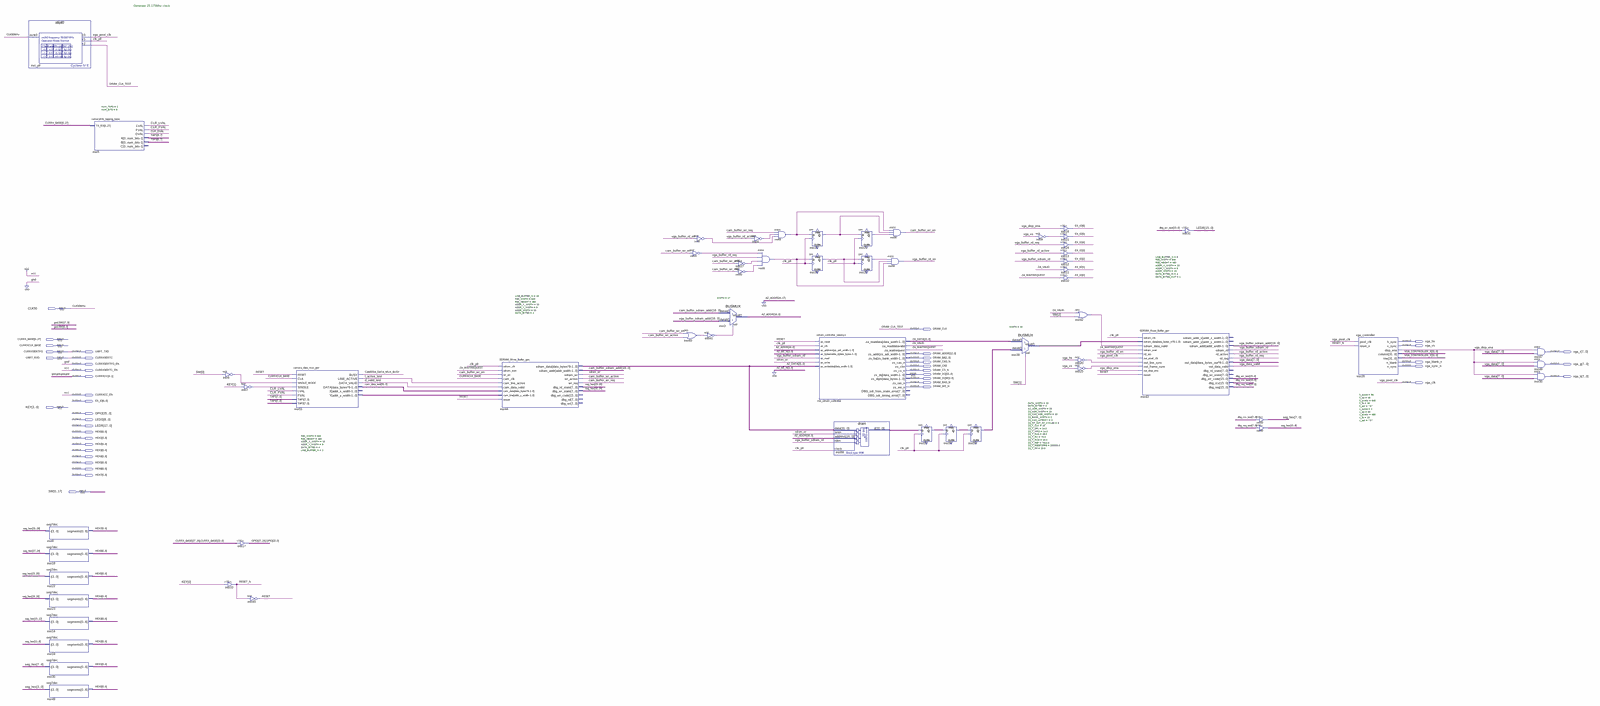
[diagram p0: schematic sheet, whole]
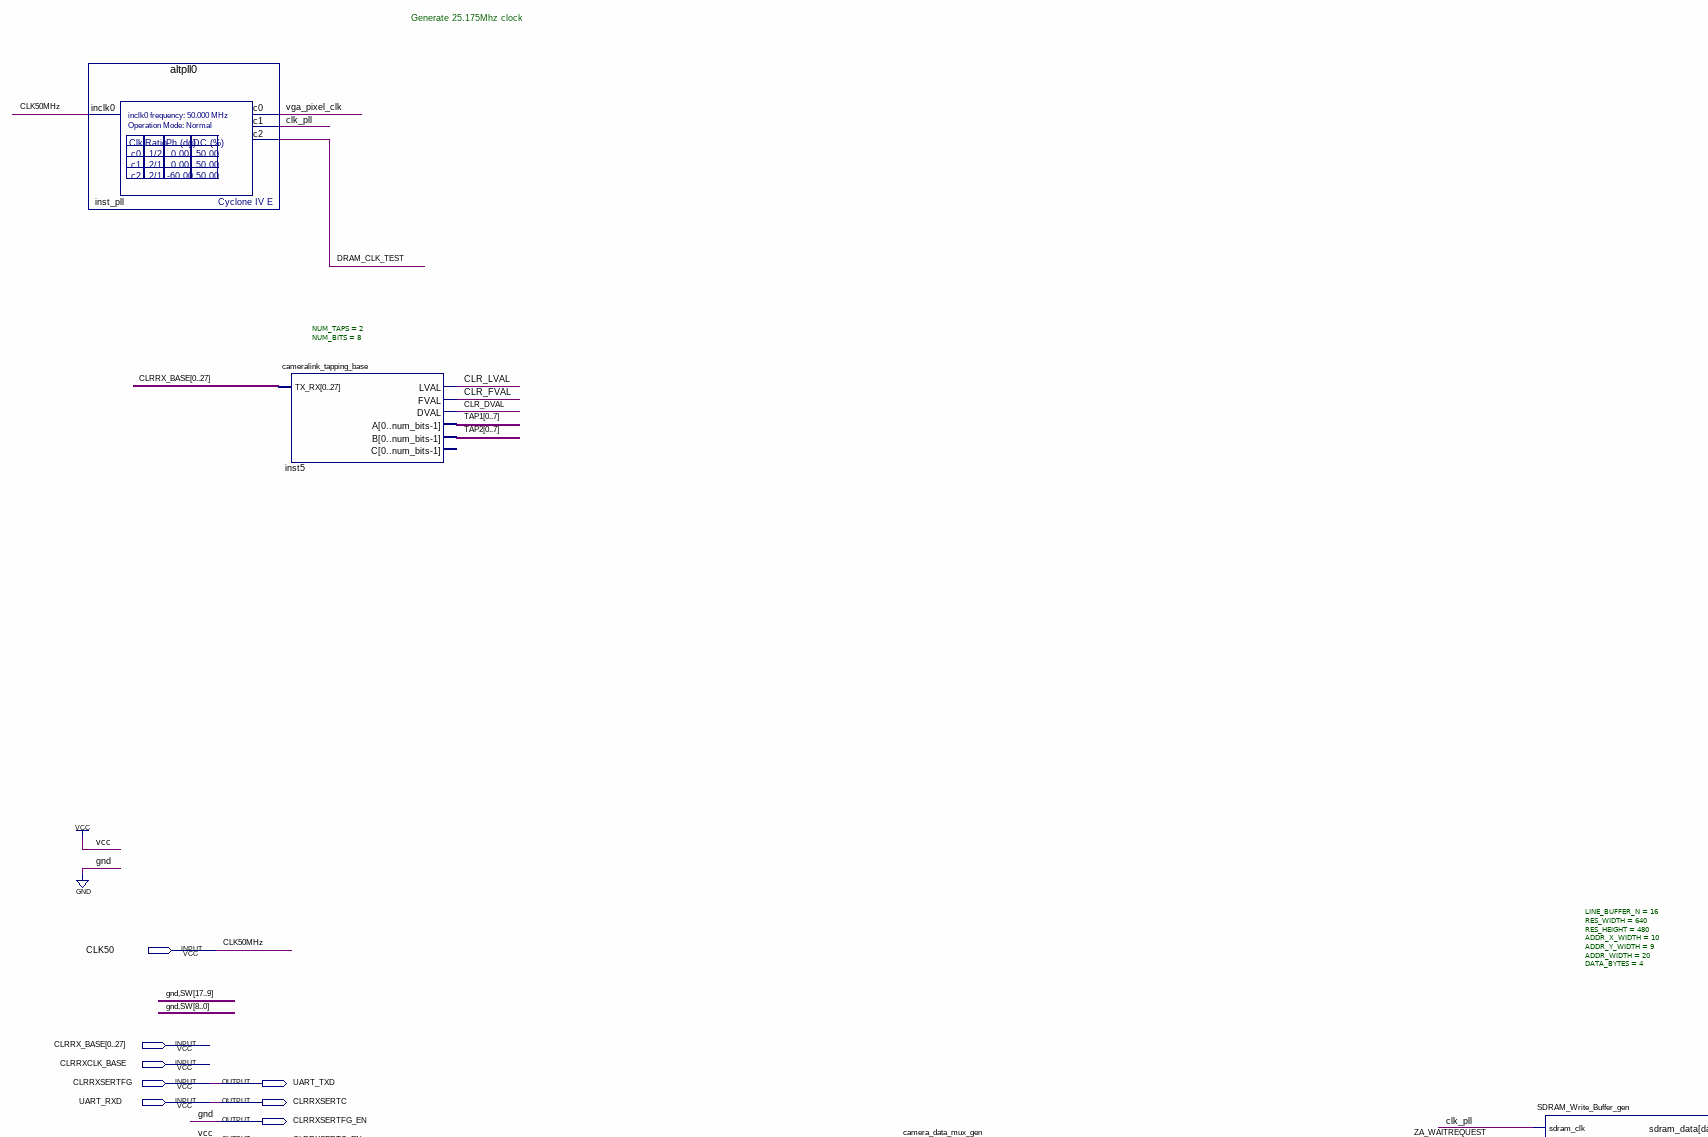
[diagram p1: schematic sheet, upper left part]
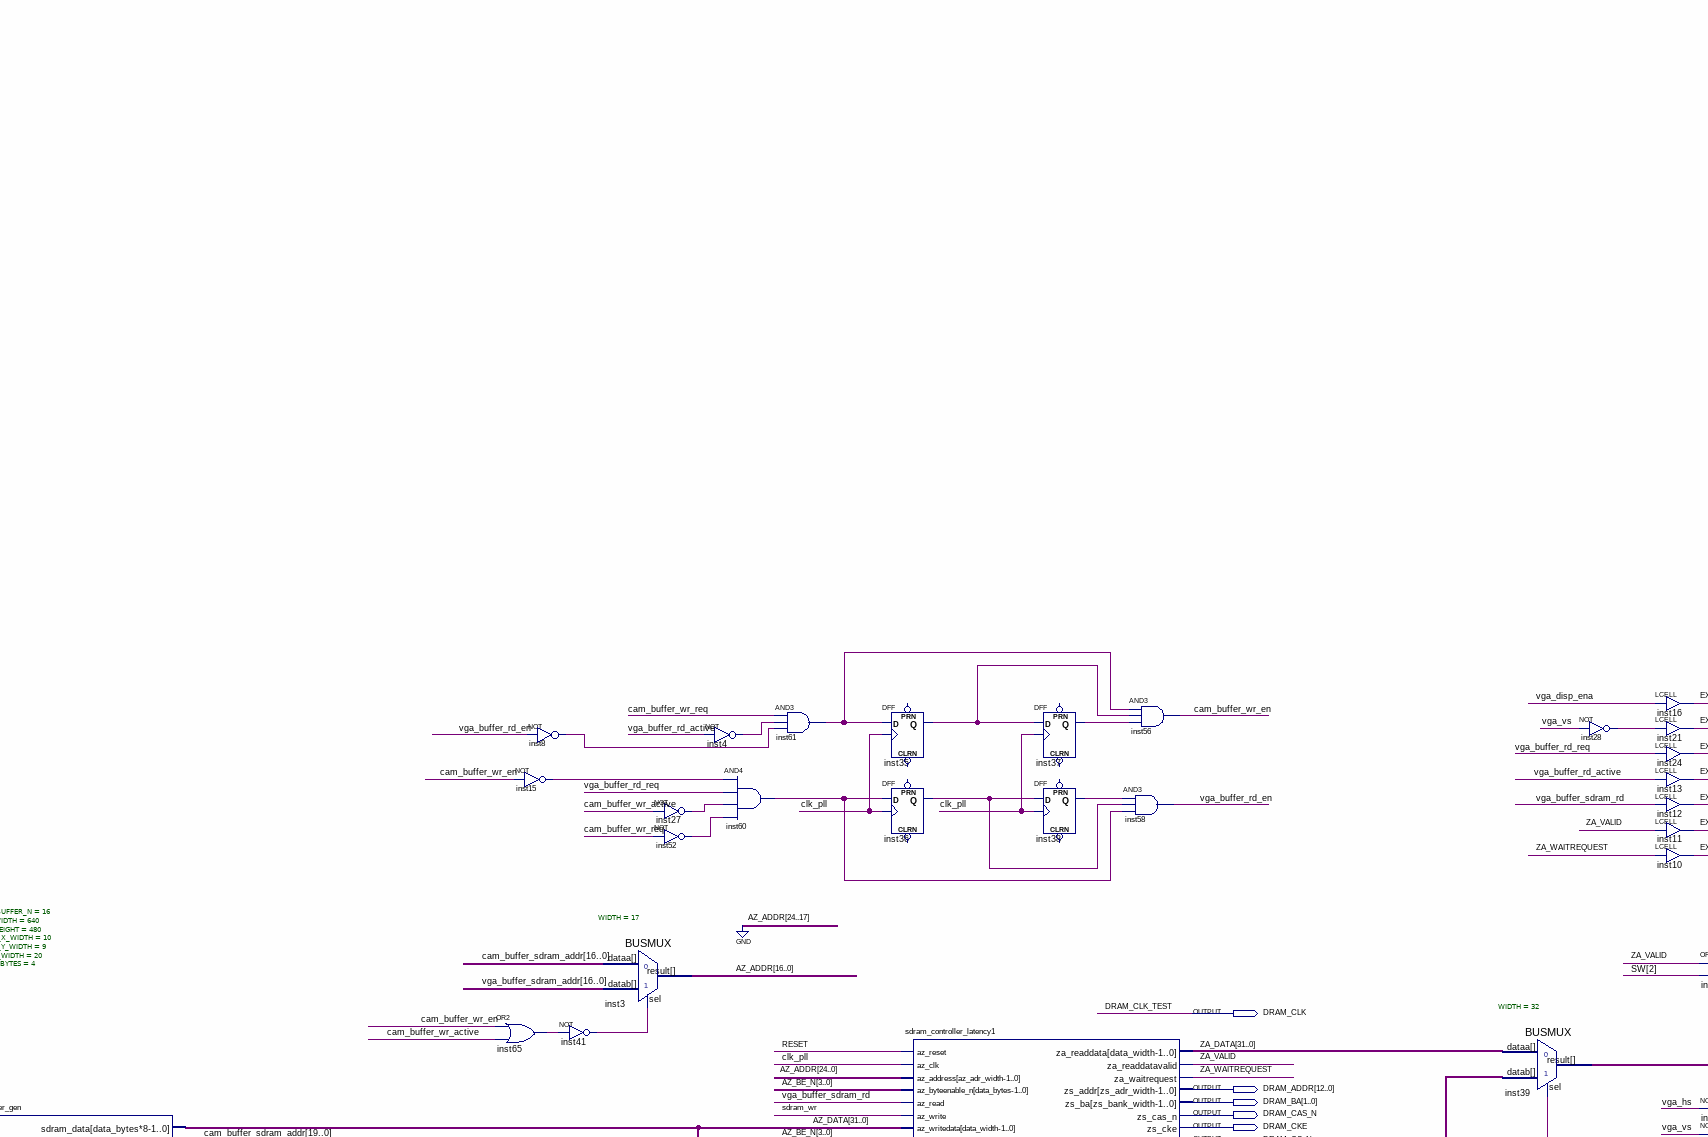
[diagram p2: schematic sheet, upper centre part]
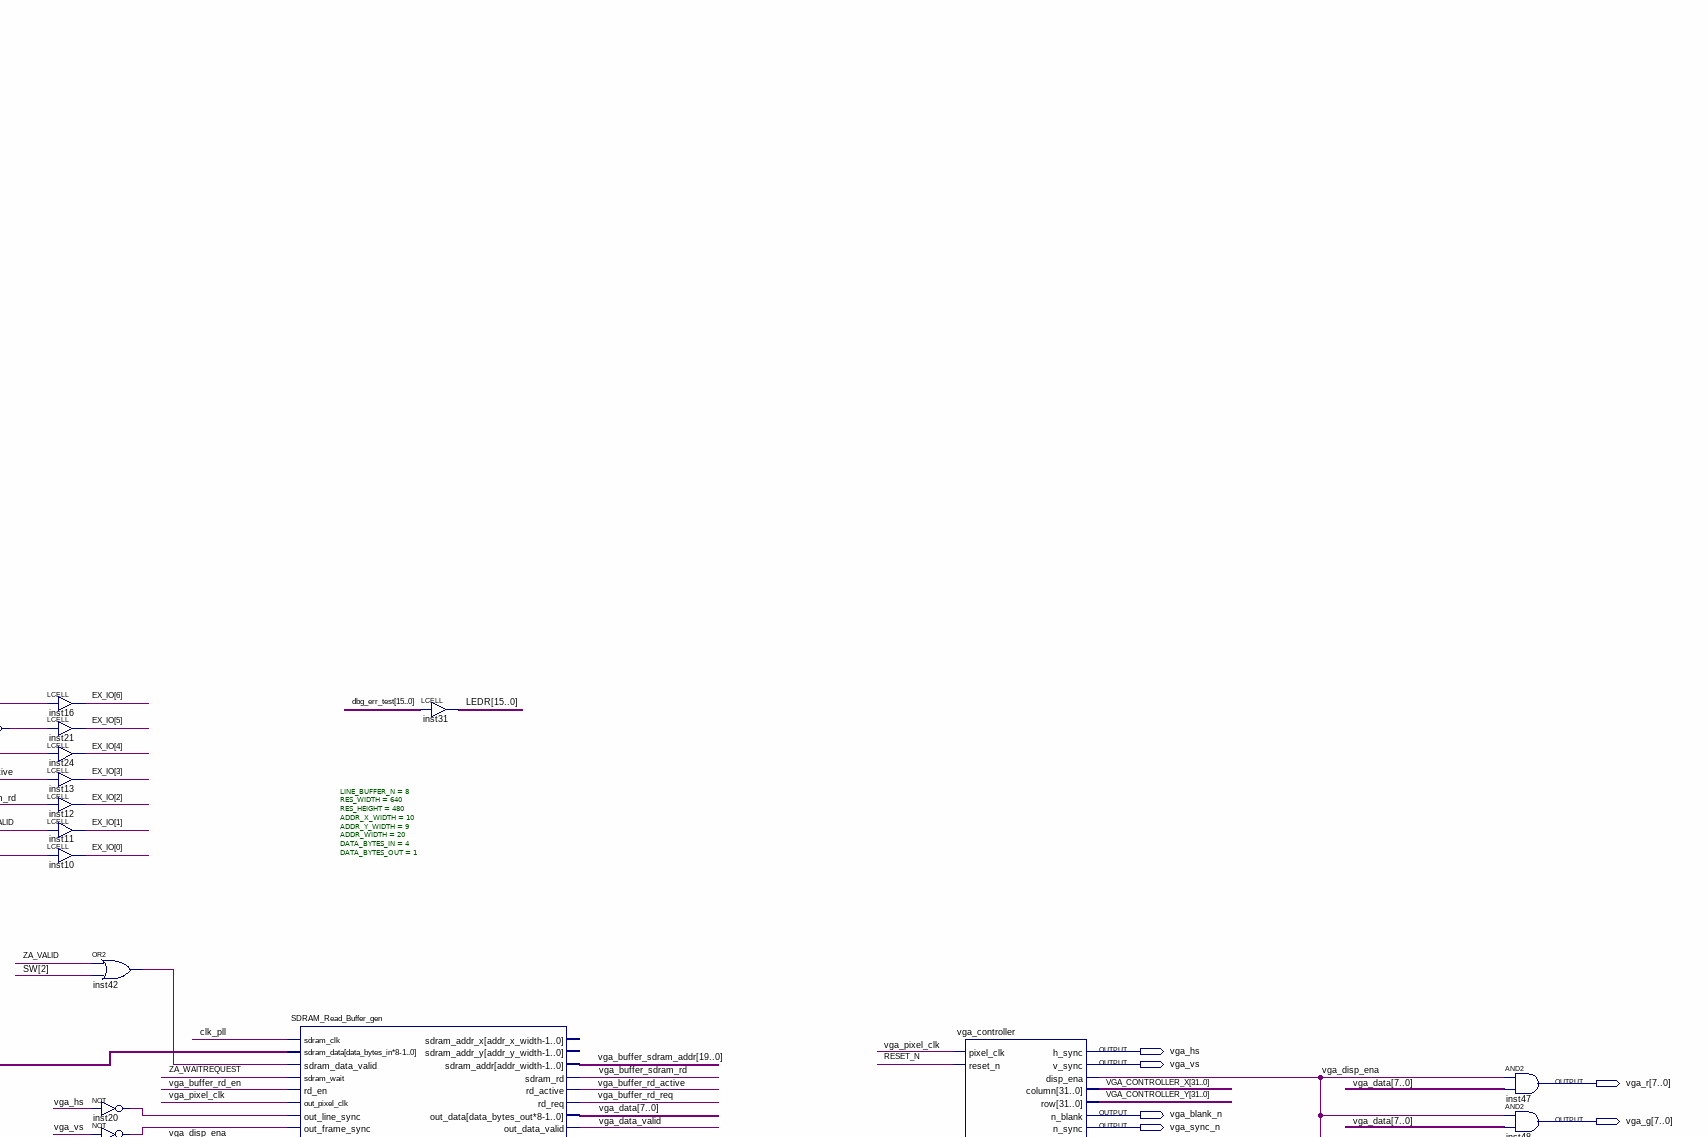
[diagram p3: schematic sheet, upper right part]
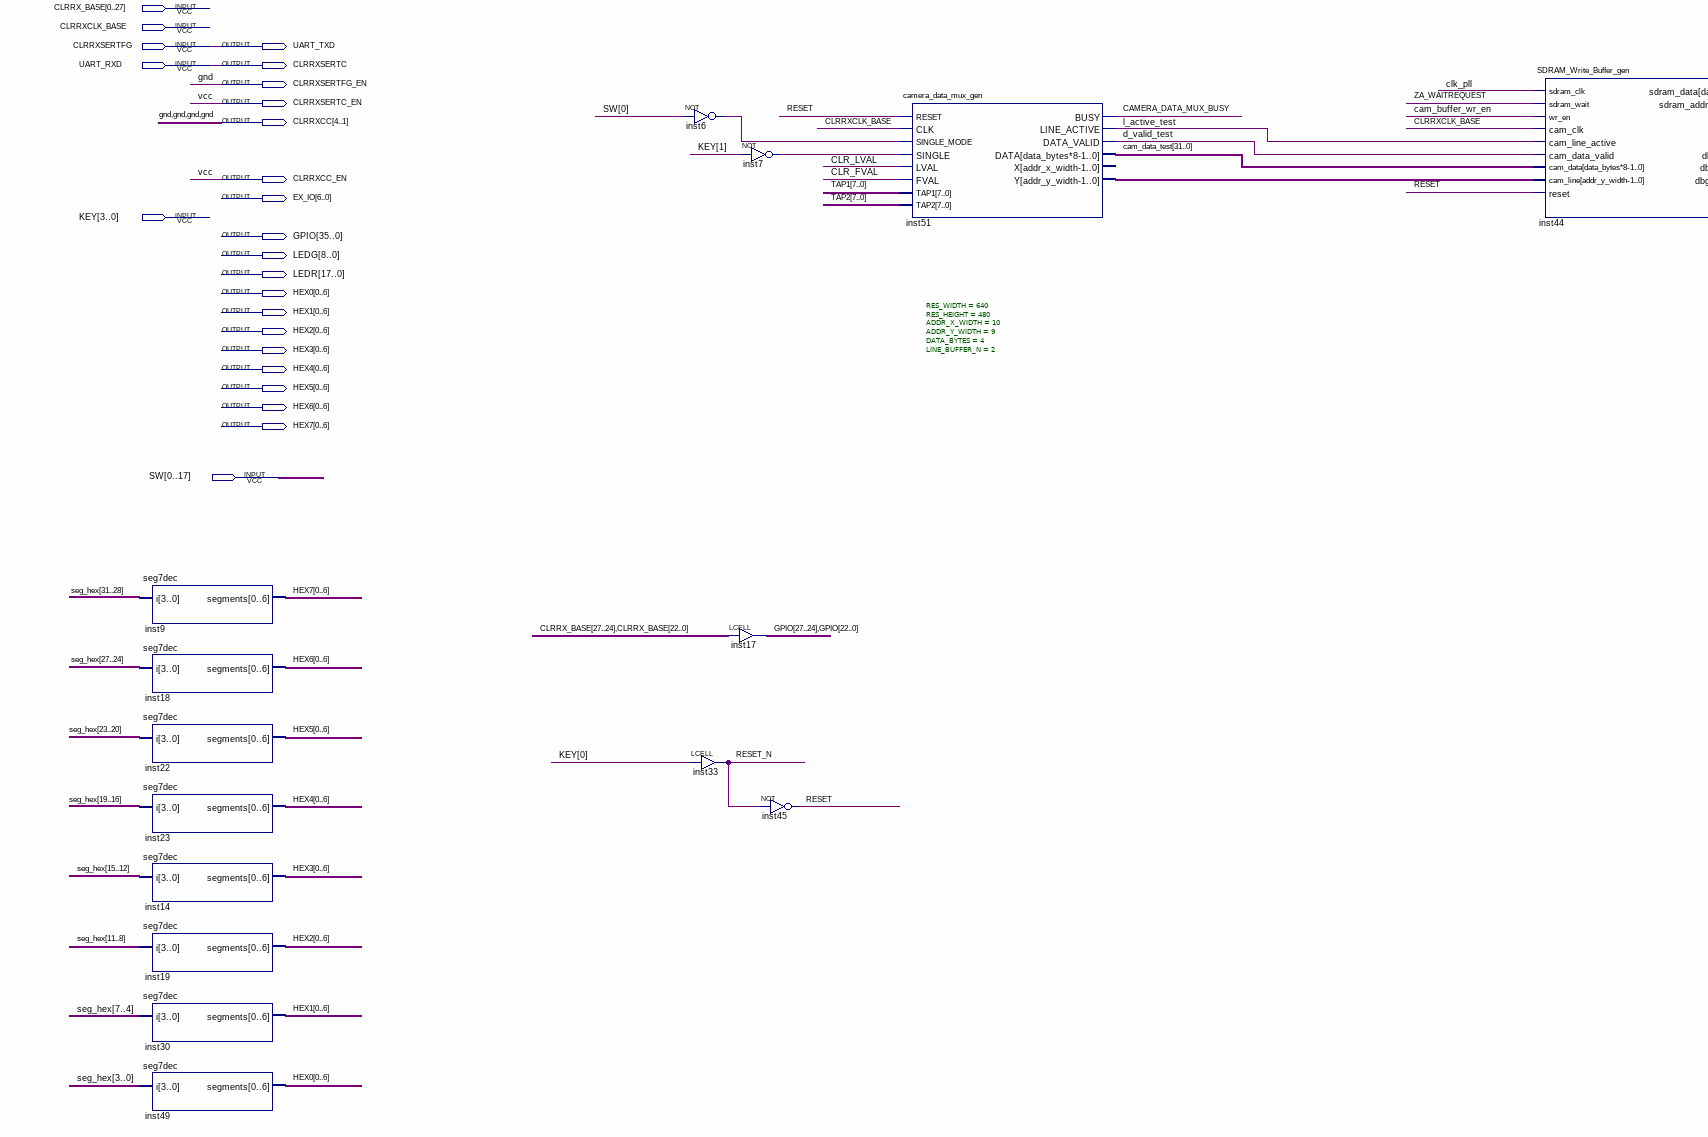
[diagram p4: schematic sheet, lower left part]
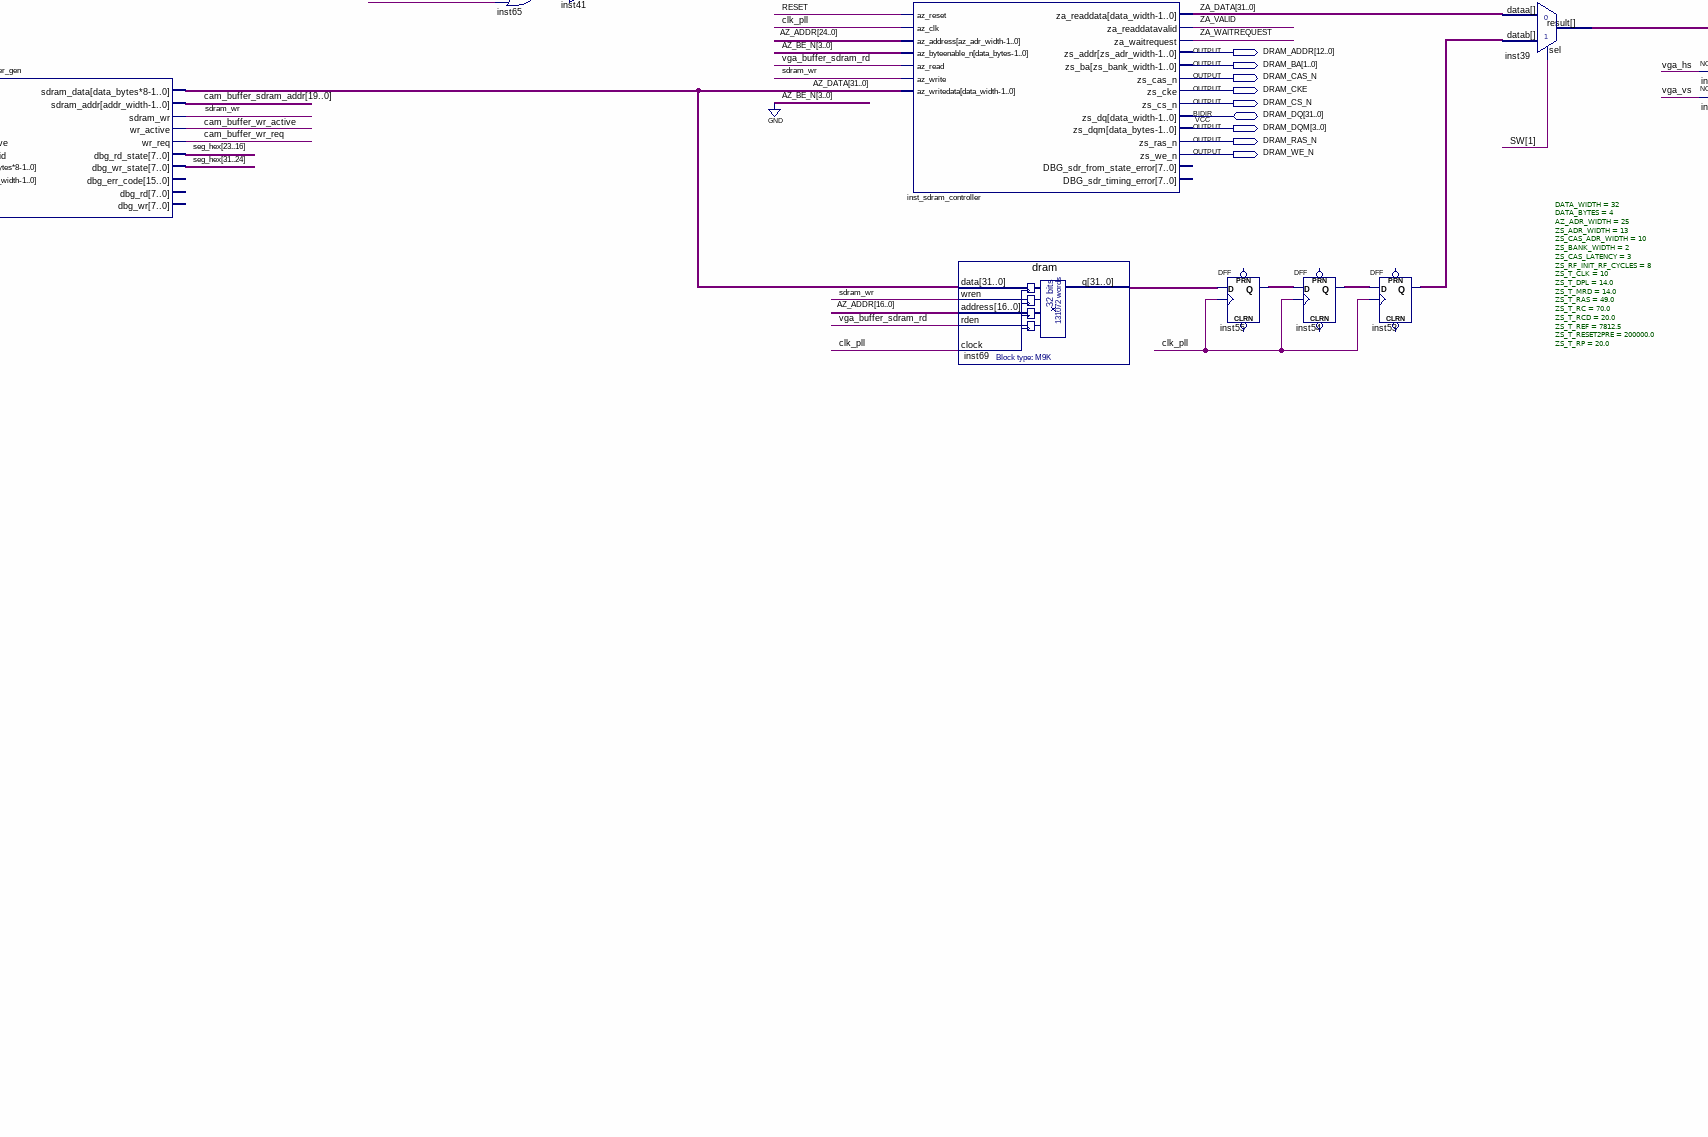
[diagram p5: schematic sheet, lower centre part]
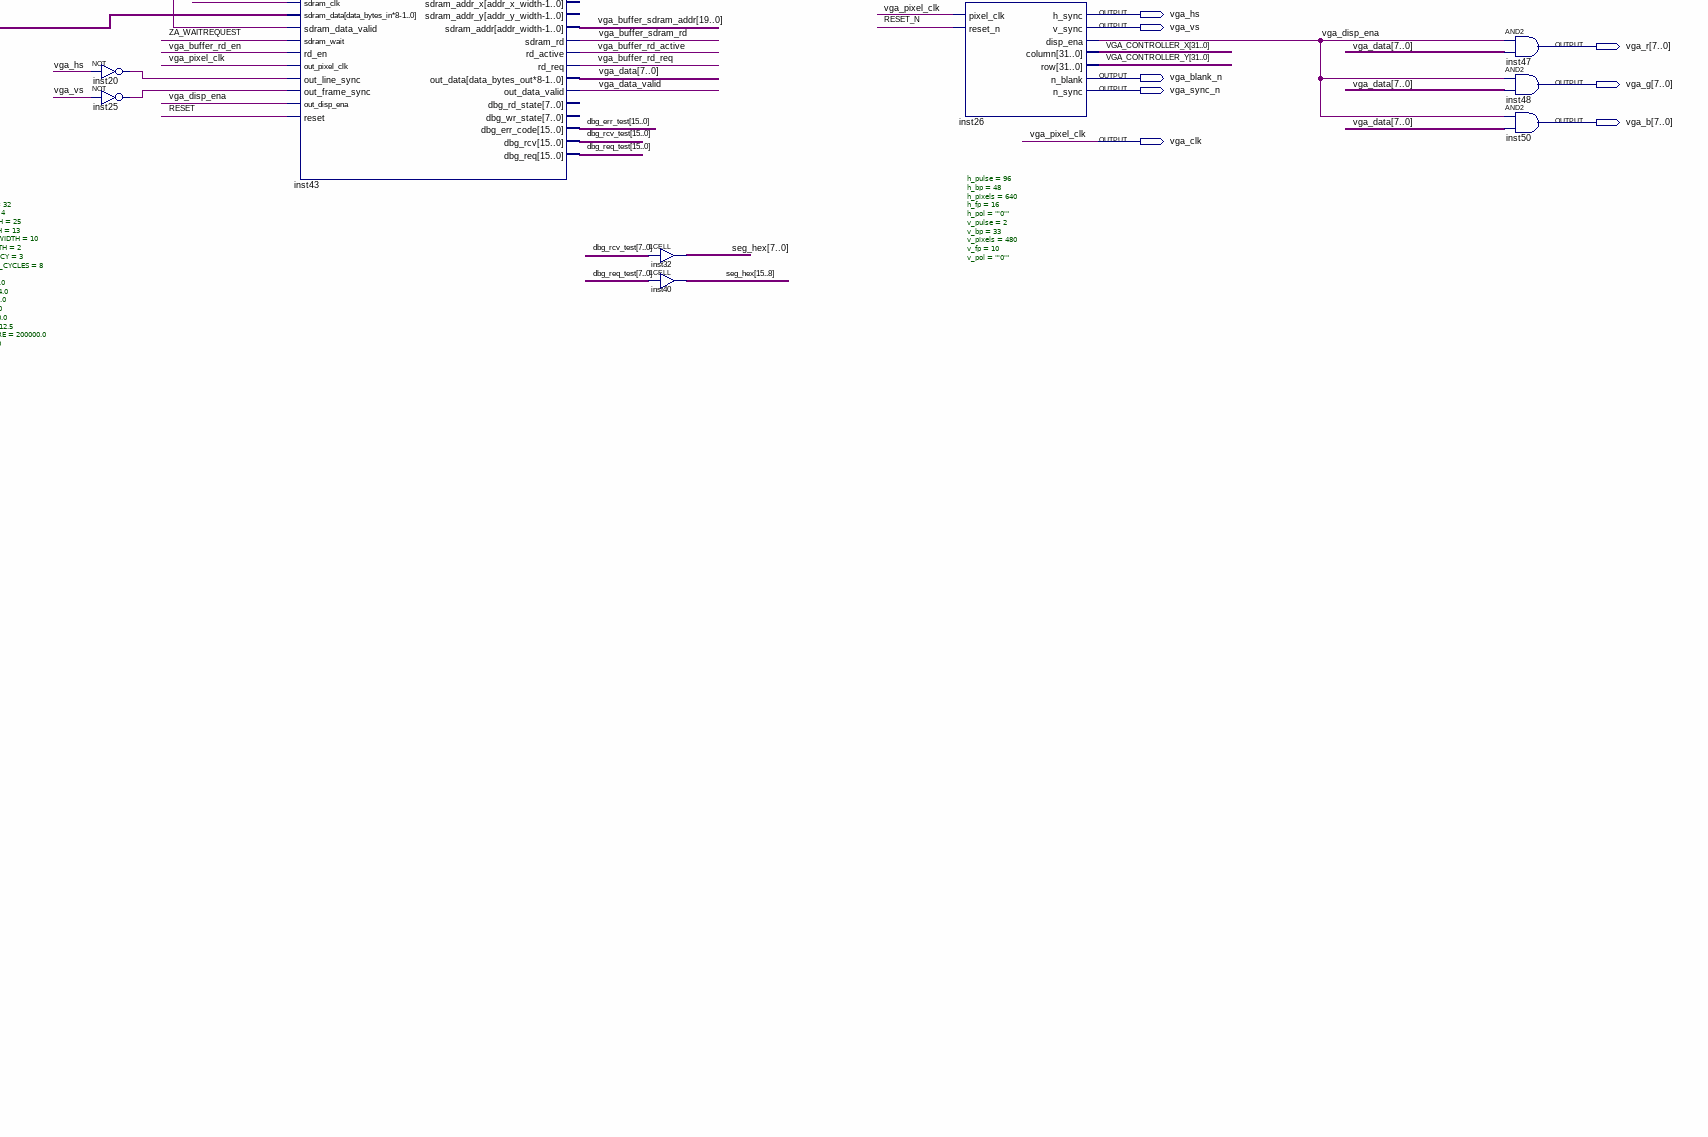
[diagram p6: schematic sheet, lower right part]
// Quartus schematic sdram-ext-read-write-buffer-generic.bdf as structural Verilog: 58 symbols, 43 pins
module \sdram-ext-read-write-buffer-generic  (
  input  CLK50,
  input  [0:27] CLRRX_BASE,
  input  CLRRXCLK_BASE,
  input  CLRRXSERTFG,
  input  UART_RXD,
  input  [3:0] KEY,
  input  [0:17] SW,
  inout  [31:0] DRAM_DQ,
  output DRAM_CLK,
  output vga_hs,
  output vga_vs,
  output UART_TXD,
  output [7:0] vga_r,
  output [12:0] DRAM_ADDR,
  output CLRRXSERTC,
  output [1:0] DRAM_BA,
  output DRAM_CAS_N,
  output vga_blank_n,
  output CLRRXSERTFG_EN,
  output [7:0] vga_g,
  output DRAM_CKE,
  output vga_sync_n,
  output CLRRXSERTC_EN,
  output DRAM_CS_N,
  output [4:1] CLRRXCC,
  output [7:0] vga_b,
  output [3:0] DRAM_DQM,
  output DRAM_RAS_N,
  output vga_clk,
  output DRAM_WE_N,
  output CLRRXCC_EN,
  output [6:0] EX_IO,
  output [35:0] GPIO,
  output [8:0] LEDG,
  output [17:0] LEDR,
  output [0:6] HEX0,
  output [0:6] HEX1,
  output [0:6] HEX2,
  output [0:6] HEX3,
  output [0:6] HEX4,
  output [0:6] HEX5,
  output [0:6] HEX6,
  output [0:6] HEX7
);

  wire cam_buffer_wr_active, cam_buffer_wr_en, cam_buffer_wr_req, CAMERA_DATA_MUX_BUSY, clk_pll, CLR_DVAL,
       CLR_FVAL, CLR_LVAL, d_valid_test, inst4_out, inst6_out, inst7_out, inst8_out, inst15_out, inst20_out,
       inst25_out, inst27_out, inst28_out, inst35_q, inst36_q, inst37_q, inst38_q, inst41_out, inst42_out,
       inst52_out, inst60_out, inst61_out, inst65_out, l_active_test, RESET, RESET_N, sdram_wr,
       vga_buffer_rd_active, vga_buffer_rd_en, vga_buffer_rd_req, vga_buffer_sdram_rd, vga_data_valid,
       vga_disp_ena, ZA_VALID, ZA_WAITREQUEST;
  wire [7:0] TAP1, TAP2, vga_data;
  wire [8:0] inst51_y;
  wire [15:0] dbg_err_test, dbg_rcv_test, dbg_req_test;
  wire [16:0] AZ_ADDR;
  wire [19:0] cam_buffer_sdram_addr, vga_buffer_sdram_addr;
  wire [31:0] AZ_DATA, cam_data_test, inst39_result, inst53_q, inst54_q, inst55_q, inst69_q, seg_hex,
       VGA_CONTROLLER_X, VGA_CONTROLLER_Y, ZA_DATA;

  altpll0 inst_pll (.inclk0(CLK50), .c0(vga_clk), .c1(clk_pll), .c2(DRAM_CLK));
  seg7dec inst9 (.i(seg_hex[31:28]), .segments(HEX7));
  seg7dec inst18 (.i(seg_hex[27:24]), .segments(HEX6));
  seg7dec inst22 (.i(seg_hex[23:20]), .segments(HEX5));
  seg7dec inst23 (.i(seg_hex[19:16]), .segments(HEX4));
  seg7dec inst14 (.i(seg_hex[15:12]), .segments(HEX3));
  seg7dec inst19 (.i(seg_hex[11:8]), .segments(HEX2));
  seg7dec inst30 (.i(seg_hex[7:4]), .segments(HEX1));
  seg7dec inst49 (.i(seg_hex[3:0]), .segments(HEX0));
  cameralink_tapping_base #(.NUM_TAPS(2), .NUM_BITS(8)) inst5 (
    .TX_RX(CLRRX_BASE), .LVAL(CLR_LVAL), .FVAL(CLR_FVAL), .DVAL(CLR_DVAL),
    .A({TAP1[0], TAP1[1], TAP1[2], TAP1[3], TAP1[4], TAP1[5], TAP1[6], TAP1[7]}),
    .B({TAP2[0], TAP2[1], TAP2[2], TAP2[3], TAP2[4], TAP2[5], TAP2[6], TAP2[7]}));  // open: C
  not inst6 (inst6_out, SW[0]);
  LCELL inst33 (.IN(KEY[0]), .OUT(RESET_N));
  not inst7 (inst7_out, KEY[1]);
  LCELL inst17[26:0] (
    .IN({CLRRX_BASE[27], CLRRX_BASE[26], CLRRX_BASE[25], CLRRX_BASE[24], CLRRX_BASE[22], CLRRX_BASE[21], CLRRX_BASE[20], CLRRX_BASE[19], CLRRX_BASE[18], CLRRX_BASE[17], CLRRX_BASE[16], CLRRX_BASE[15], CLRRX_BASE[14], CLRRX_BASE[13], CLRRX_BASE[12], CLRRX_BASE[11], CLRRX_BASE[10], CLRRX_BASE[9], CLRRX_BASE[8], CLRRX_BASE[7], CLRRX_BASE[6], CLRRX_BASE[5], CLRRX_BASE[4], CLRRX_BASE[3], CLRRX_BASE[2], CLRRX_BASE[1], CLRRX_BASE[0]}),
    .OUT({GPIO[27:24], GPIO[22:0]}));
  not inst45 (RESET, RESET_N);
  camera_data_mux_gen #(.RES_WIDTH(640), .RES_HEIGHT(480), .ADDR_X_WIDTH(10), .ADDR_Y_WIDTH(9), .DATA_BYTES(4), .LINE_BUFFER_N(2)) inst51 (
    .RESET(RESET), .CLK(CLRRXCLK_BASE), .SINGLE_MODE(inst6_out), .SINGLE(inst7_out), .LVAL(CLR_LVAL),
    .FVAL(CLR_FVAL), .TAP1(TAP1), .TAP2(TAP2), .BUSY(CAMERA_DATA_MUX_BUSY), .LINE_ACTIVE(l_active_test),
    .DATA_VALID(d_valid_test), .DATA(cam_data_test), .Y(inst51_y));  // open: X
  SDRAM_Write_Buffer_gen #(.LINE_BUFFER_N(16), .RES_WIDTH(640), .RES_HEIGHT(480), .ADDR_X_WIDTH(10), .ADDR_Y_WIDTH(9), .ADDR_WIDTH(20), .DATA_BYTES(4)) inst44 (
    .sdram_clk(clk_pll), .sdram_wait(ZA_WAITREQUEST), .wr_en(cam_buffer_wr_en), .cam_clk(CLRRXCLK_BASE),
    .cam_line_active(l_active_test), .cam_data_valid(d_valid_test), .cam_data(cam_data_test),
    .cam_line(inst51_y), .reset(RESET), .sdram_data(AZ_DATA), .sdram_addr(cam_buffer_sdram_addr),
    .sdram_wr(sdram_wr), .wr_active(cam_buffer_wr_active), .wr_req(cam_buffer_wr_req),
    .dbg_rd_state(seg_hex[23:16]), .dbg_wr_state(seg_hex[31:24]));  // open: dbg_err_code, dbg_rd, dbg_wr
  not inst8 (inst8_out, vga_buffer_rd_en);
  not inst15 (inst15_out, cam_buffer_wr_en);
  or inst65 (inst65_out, cam_buffer_wr_en, cam_buffer_wr_active);
  not inst41 (inst41_out, inst65_out);
  BUSMUX #(.WIDTH(17)) inst3 (
    .datab(vga_buffer_sdram_addr[16:0]), .sel(inst41_out), .dataa(cam_buffer_sdram_addr[16:0]),
    .result(AZ_ADDR));
  not inst27 (inst27_out, cam_buffer_wr_active);
  not inst52 (inst52_out, cam_buffer_wr_req);
  not inst4 (inst4_out, vga_buffer_rd_active);
  and inst60 (inst60_out, inst15_out, vga_buffer_rd_req, inst27_out, inst52_out);
  and inst61 (inst61_out, cam_buffer_wr_req, inst4_out, inst8_out);
  DFF inst35 (.CLK(clk_pll), .D(inst61_out), .Q(inst35_q));  // open: CLRN, PRN
  DFF inst36 (.CLK(clk_pll), .D(inst60_out), .Q(inst36_q));  // open: CLRN, PRN
  sdram_controller_latency1 #(.DATA_WIDTH(32), .DATA_BYTES(4), .AZ_ADR_WIDTH(25), .ZS_ADR_WIDTH(13), .ZS_CAS_ADR_WIDTH(10), .ZS_BANK_WIDTH(2), .ZS_CAS_LATENCY(3), .ZS_RF_INIT_RF_CYCLES(8), .ZS_T_CLK(10), .ZS_T_DPL(14.0), .ZS_T_MRD(14.0), .ZS_T_RAS(49.0), .ZS_T_RC(70.0), .ZS_T_RCD(20.0), .ZS_T_REF(7812.5), .ZS_T_RESET2PRE(200000.0), .ZS_T_RP(20.0)) inst_sdram_controller (
    .az_reset(RESET), .az_clk(clk_pll), .az_address({{8{1'b0}}, AZ_ADDR}), .az_byteenable_n(4'b0000),
    .az_read(vga_buffer_sdram_rd), .az_write(sdram_wr), .az_writedata(AZ_DATA), .za_readdata(ZA_DATA),
    .za_readdatavalid(ZA_VALID), .za_waitrequest(ZA_WAITREQUEST), .zs_addr(DRAM_ADDR), .zs_ba(DRAM_BA),
    .zs_cas_n(DRAM_CAS_N), .zs_cke(DRAM_CKE), .zs_cs_n(DRAM_CS_N), .zs_dqm(DRAM_DQM), .zs_ras_n(DRAM_RAS_N),
    .zs_we_n(DRAM_WE_N), .zs_dq(DRAM_DQ));  // open: DBG_sdr_from_state_error, DBG_sdr_timing_error
  dram inst69 (
    .data(AZ_DATA), .wren(sdram_wr), .address(AZ_ADDR), .rden(vga_buffer_sdram_rd), .clock(clk_pll),
    .q(inst69_q));
  DFF inst37 (.CLK(clk_pll), .D(inst35_q), .Q(inst37_q));  // open: CLRN, PRN
  DFF inst38 (.CLK(clk_pll), .D(inst36_q), .Q(inst38_q));  // open: CLRN, PRN
  and inst56 (cam_buffer_wr_en, inst61_out, inst35_q, inst37_q);
  and inst58 (vga_buffer_rd_en, inst38_q, inst36_q, inst60_out);
  DFF inst55[31:0] (.CLK(clk_pll), .D(inst69_q), .Q(inst55_q));  // open: CLRN, PRN
  DFF inst54[31:0] (.CLK(clk_pll), .D(inst55_q), .Q(inst54_q));  // open: CLRN, PRN
  DFF inst53[31:0] (.CLK(clk_pll), .D(inst54_q), .Q(inst53_q));  // open: CLRN, PRN
  BUSMUX #(.WIDTH(32)) inst39 (.datab(inst53_q), .sel(SW[1]), .dataa(ZA_DATA), .result(inst39_result));
  not inst28 (inst28_out, vga_vs);
  LCELL inst16 (.IN(vga_disp_ena), .OUT(EX_IO[6]));
  LCELL inst21 (.IN(inst28_out), .OUT(EX_IO[5]));
  LCELL inst24 (.IN(vga_buffer_rd_req), .OUT(EX_IO[4]));
  LCELL inst13 (.IN(vga_buffer_rd_active), .OUT(EX_IO[3]));
  LCELL inst12 (.IN(vga_buffer_sdram_rd), .OUT(EX_IO[2]));
  LCELL inst11 (.IN(ZA_VALID), .OUT(EX_IO[1]));
  LCELL inst10 (.IN(ZA_WAITREQUEST), .OUT(EX_IO[0]));
  or inst42 (inst42_out, ZA_VALID, SW[2]);
  not inst20 (inst20_out, vga_hs);
  not inst25 (inst25_out, vga_vs);
  SDRAM_Read_Buffer_gen #(.LINE_BUFFER_N(8), .RES_WIDTH(640), .RES_HEIGHT(480), .ADDR_X_WIDTH(10), .ADDR_Y_WIDTH(9), .ADDR_WIDTH(20), .DATA_BYTES_IN(4), .DATA_BYTES_OUT(1)) inst43 (
    .sdram_clk(clk_pll), .sdram_data(inst39_result), .sdram_data_valid(inst42_out),
    .sdram_wait(ZA_WAITREQUEST), .rd_en(vga_buffer_rd_en), .out_pixel_clk(vga_clk),
    .out_line_sync(inst20_out), .out_frame_sync(inst25_out), .out_disp_ena(vga_disp_ena), .reset(RESET),
    .sdram_addr(vga_buffer_sdram_addr), .sdram_rd(vga_buffer_sdram_rd), .rd_active(vga_buffer_rd_active),
    .rd_req(vga_buffer_rd_req), .out_data(vga_data), .out_data_valid(vga_data_valid),
    .dbg_err_code(dbg_err_test), .dbg_rcv(dbg_rcv_test), .dbg_req(dbg_req_test));  // open: sdram_addr_x, sdram_addr_y, dbg_rd_state, dbg_wr_state
  LCELL inst31[15:0] (.IN(dbg_err_test), .OUT(LEDR[15:0]));
  LCELL inst32[7:0] (.IN(dbg_rcv_test[7:0]), .OUT(seg_hex[7:0]));
  LCELL inst40[7:0] (.IN(dbg_req_test[7:0]), .OUT(seg_hex[15:8]));
  vga_controller #(.h_pulse(96), .h_bp(48), .h_pixels(640), .h_fp(16), .h_pol("'0'"), .v_pulse(2), .v_bp(33), .v_pixels(480), .v_fp(10), .v_pol("'0'")) inst26 (
    .pixel_clk(vga_clk), .reset_n(RESET_N), .h_sync(vga_hs), .v_sync(vga_vs), .disp_ena(vga_disp_ena),
    .column(VGA_CONTROLLER_X), .row(VGA_CONTROLLER_Y), .n_blank(vga_blank_n), .n_sync(vga_sync_n));
  assign vga_r = {8{vga_disp_ena}} & vga_data;  // AND2 inst47, 8 bits wide
  assign vga_g = {8{vga_disp_ena}} & vga_data;  // AND2 inst48, 8 bits wide
  assign vga_b = {8{vga_disp_ena}} & vga_data;  // AND2 inst50, 8 bits wide

  assign CLRRXCC = 4'b0000;
  assign CLRRXCC_EN = 1'b1;
  assign CLRRXSERTC = UART_RXD;
  assign CLRRXSERTC_EN = 1'b1;
  assign CLRRXSERTFG_EN = 1'b0;
  assign UART_TXD = CLRRXSERTFG;

  // Other names for the same wires on the sheet: CLK50MHz = CLK50; DRAM_CLK_TEST = DRAM_CLK; vga_pixel_clk = vga_clk

  // Notes on the sheet:
  //   Generate 25.175Mhz clock
endmodule
